# EAGLE design PCD (EAGLE 9.5.1)
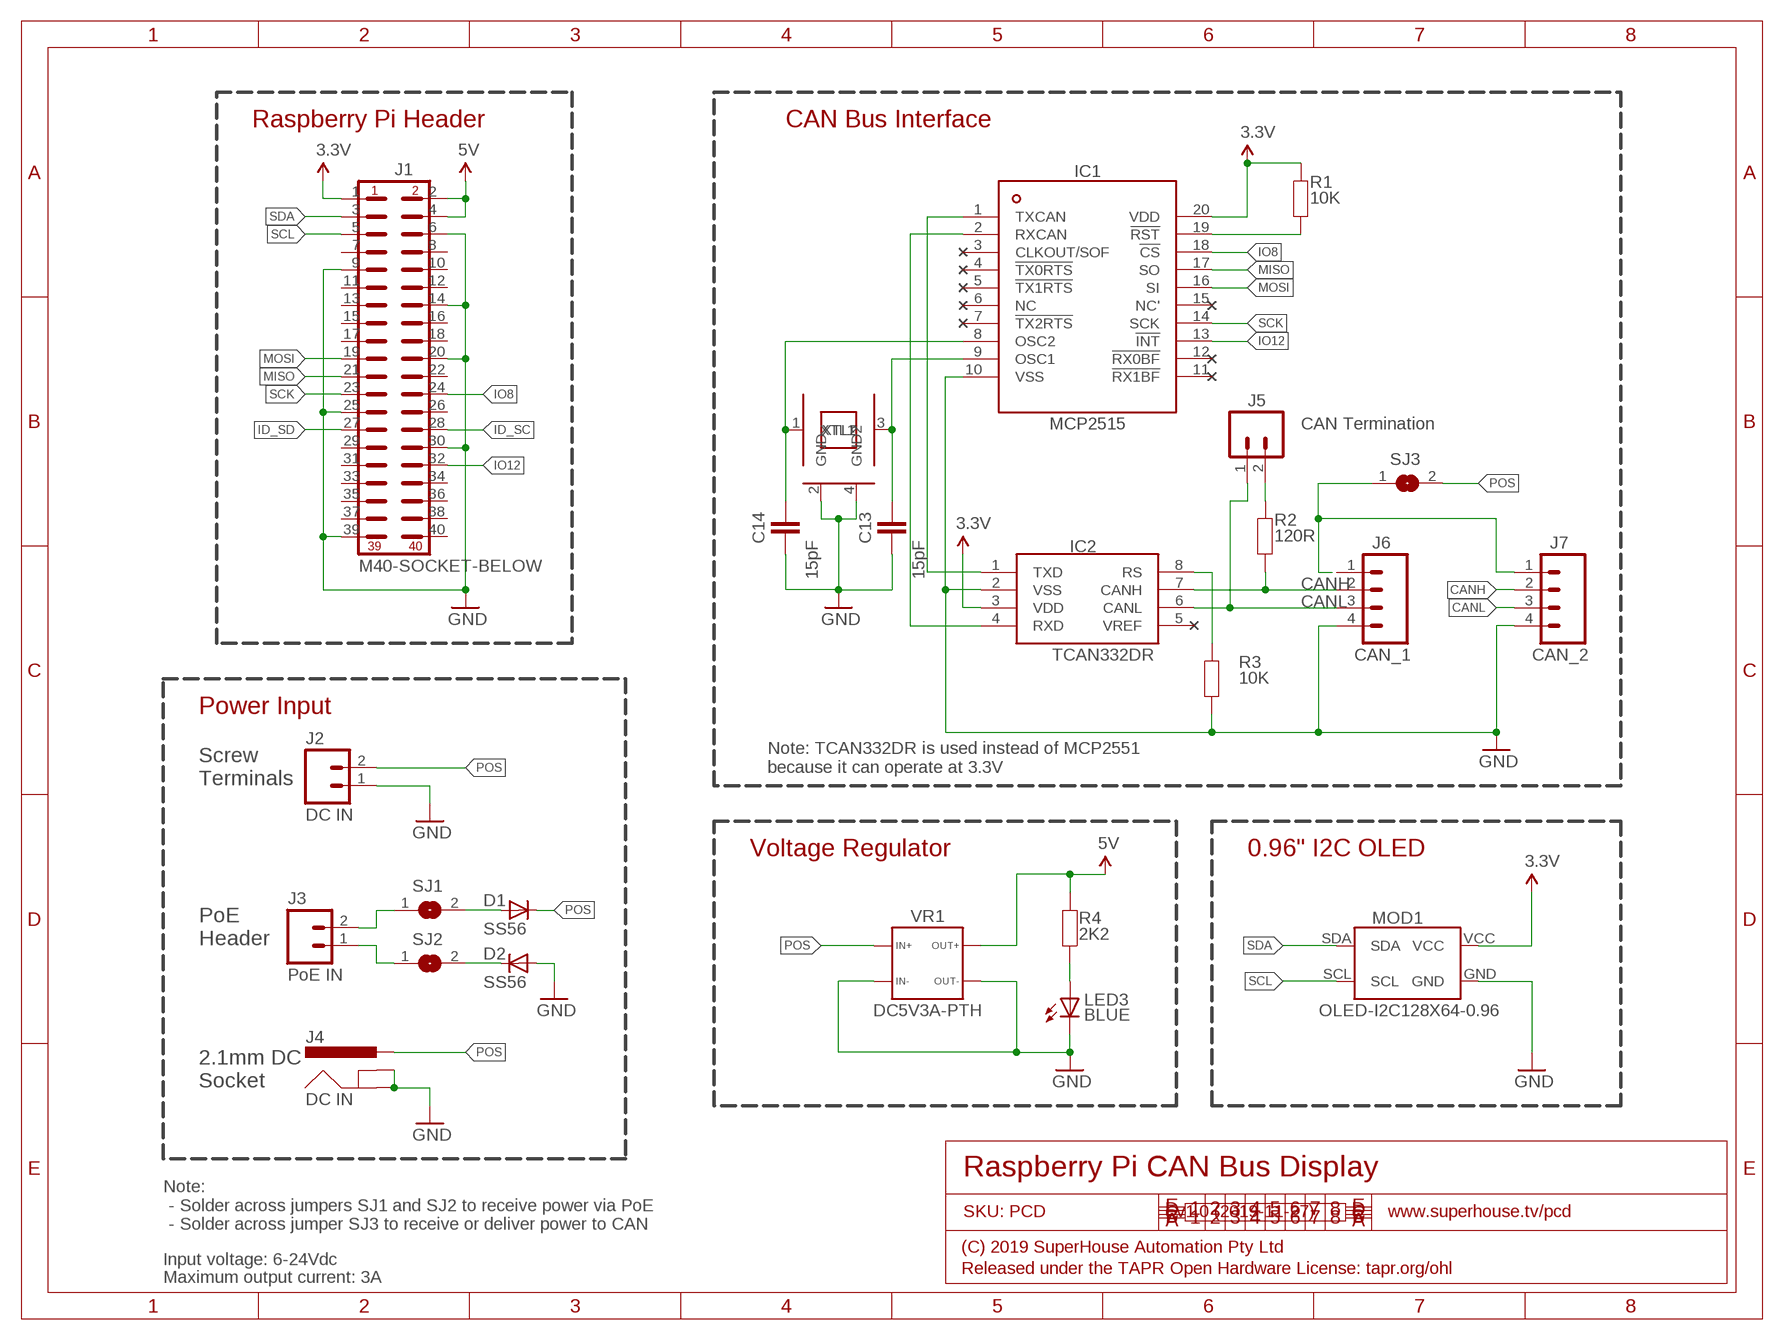
[diagram p0: schematic, sheet 1]

## Parts
C13  15pF  CAP0603  [C0603]
C14  15pF  CAP0603  [C0603]
D1  SS56  DIODESMA  [SMA-DIODE]
D2  SS56  DIODESMA  [SMA-DIODE]
IC1  MCP2515  [TSSOP20]
IC2  TCAN332DR  MCP2551  [SO08]
J1  M40-SOCKET-BELOW  [2X20-S-BELOW]
J2  DC IN  M02-SCREW-3.5MM  [SCREWTERMINAL-3.5MM-2]
J3  PoE IN  M02-SOCKET-BELOW  [1X02-S-BELOW]
J4  DC IN  POWER_JACK-SLOTS  [POWER_JACK_SLOTS]
J5  CAN Termination  M02-PIN  [1X02-P]
J6  CAN_1  M04-PIN  [1X04-P]
J7  CAN_2  M04-PIN  [1X04-P]
LED3  BLUE  LED0603  [LED-0603]
MOD1  OLED-I2C128X64-0.96  [OLED-128X64-0.96]
R1  10K  RESISTOR0603  [R0603]
R2  120R  RESISTOR0603  [R0603]
R3  10K  RESISTOR0603  [R0603]
R4  2K2  RESISTOR0603  [R0603]
SJ1  SJN  [SJ]
SJ2  SJN  [SJ]
SJ3  SJN  [SJ]
VR1  DC5V3A-PTH  [DC5V3A-PTH]
XTL3  16MHz  CRYSTAL-GND3X2  [CRYSTAL-SMD-3X2]

## Nets
3.3V: IC1.20(VDD) IC2.3(VDD) J1.1 MOD1.VCC R1.2
5V: J1.2 J1.4 R4.1 VR1.3A VR1.3B
CAN_PWR: J6.1 J7.1 SJ3.1
CANH: IC2.7(CANH) J6.2 J7.2 R2.1
CANL: IC2.6(CANL) J5.1 J6.3 J7.3
GND: C13.1 C14.1 D2.A IC1.10(VSS) IC2.2(VSS) J1.6 J1.9 J1.14 J1.20 J1.25 J1.30 J1.39 J2.1 J4.GND J4.GNDBREAK J6.4 J7.4 LED3.C MOD1.GND R3.1 VR1.1A VR1.1B VR1.4A VR1.4B XTL3.2(GND) XTL3.4(GND2)
ID_SC: J1.28
ID_SD: J1.27
IO8: IC1.18(!CS) J1.24
IO12: IC1.13(!INT) J1.32
MISO: IC1.17(SO) J1.21
MOSI: IC1.16(SI) J1.19
N$1: J3.1 SJ2.1
N$2: J3.2 SJ1.1
N$3: J5.2 R2.2
N$24: D1.A SJ1.2
N$25: D2.C SJ2.2
N$26: IC2.8(RS) R3.2
N$28: IC1.1(TXCAN) IC2.1(TXD)
N$29: IC1.2(RXCAN) IC2.4(RXD)
N$30: C13.2 IC1.9(OSC1) XTL3.3(XTL2)
N$48: C14.2 IC1.8(OSC2) XTL3.1(XTL1)
N$49: IC1.19(!RST) R1.1
N$203: LED3.A R4.2
POS: D1.C J2.2 J4.PWR SJ3.2 VR1.2A VR1.2B
SCK: IC1.14(SCK) J1.23
SCL: J1.5 MOD1.SCL
SDA: J1.3 MOD1.SDA
Unconnected: IC1.3(CLKOUT/SOF) IC1.4(!TX0RTS) IC1.5(!TX1RTS) IC1.6(NC) IC1.7(!TX2RTS) IC1.11(!RX1BF) IC1.12(!RX0BF) IC1.15(NC') IC2.5(VREF) J1.7 J1.8 J1.10 J1.11 J1.12 J1.13 J1.15 J1.16 J1.17 J1.18 J1.22 J1.26 J1.29 J1.31 J1.33 J1.34 J1.35 J1.36 J1.37 J1.38 J1.40

## Notes on the sheet
- Raspberry Pi Header | CAN Bus Interface
- Power Input
- Note: TCAN332DR is used instead of MCP2551
  because it can operate at 3.3V
- Screw
  Terminals
- Voltage Regulator | 0.96" I2C OLED
- PoE
  Header
- 2.1mm DC
  Socket
- Raspberry Pi CAN Bus Display
- SKU: PCD | v1.0 (2019-11-27) | www.superhouse.tv/pcd
- Note:
   - Solder across jumpers SJ1 and SJ2 to receive power via PoE
   - Solder across jumper SJ3 to receive or deliver power to CAN
- (C) 2019 SuperHouse Automation Pty Ltd
- Input voltage: 6-24Vdc
- Released under the TAPR Open Hardware License: tapr.org/ohl
- Maximum output current: 3A

## Library data of the parts
C13 C14 = SuperHouse-DiscreteSemi:CAP: Capacitor Standard ceramic capacitor
D1 D2 = SuperHouse-DiscreteSemi:DIODE: Diode Standard reverse protection diodes and small signal diodes. SMA package can handle up to about 1A. SOD-323 can handle about 200mA.
IC1 = SuperHouse-ICs:MCP2515: Microchip Technology’s MCP2515 is a stand-alone Controller Area Network (CAN) controller that implements the CAN specification, version 2.0B. It is capable of transmitting and receiving both standard and extended data and remote frames. The MCP2515 has two acceptance masks and six acceptance filters that are used to filter out unwanted messages, thereby reducing the host MCUs overhead. The MCP2515 interfaces with microcontrollers (MCUs) via an industry standard Serial Peripheral Interface (SPI).
IC2 = SuperHouse-ICs:MCP2551: CAN bus transceiver. Pin compatible chips with different specs include: MCP2551 (5V only) TCAN332DR (3.3V)
J1 = SuperHouse-Connectors:M40: 40-way header
J2 J3 J5 = SuperHouse-Connectors:M02: 2-way header Standard 1x2 header, and screw terminal variations
J4 = SuperHouse-Connectors:POWER_JACK: Power Jack This is the standard 5.5mm barrel jack for power. The PTH is the most common, proven, reliable, footprint. All others are experimental. The Slot footprint only works if the mill layer is transmitted to the PCB fab house so be warned. Spark Fun Electronics SKU : PRT-00119. Mating wall wart : TOL-00298 (and others)
J6 J7 = SuperHouse-Connectors:M04: 4-way header Standard 1x4 header, and screw terminal variations
LED3 = SuperHouse-LEDs:LED: LEDs Standard schematic elements and footprints for 5mm, 3mm, 1206, and 0603 sized LEDs. 5mm - Spark Fun Electronics SKU : COM-00529 (and others)
MOD1 = SuperHouse-Displays:OLED-I2C: OLED module with SSD1306 I2C driver
R1-R4 = SuperHouse-DiscreteSemi:RESISTOR: Resistor Standard resistors.
SJ1-SJ3 = freetronics-jon:SJ: SMD solder JUMPER
VR1 = SuperHouse-Regulators:DC5V3A: 5V 3A voltage regulator module from AliExpress
XTL3 = SuperHouse-Oscillators:CRYSTAL-GND: 3x2mm SMT crystal

## Board
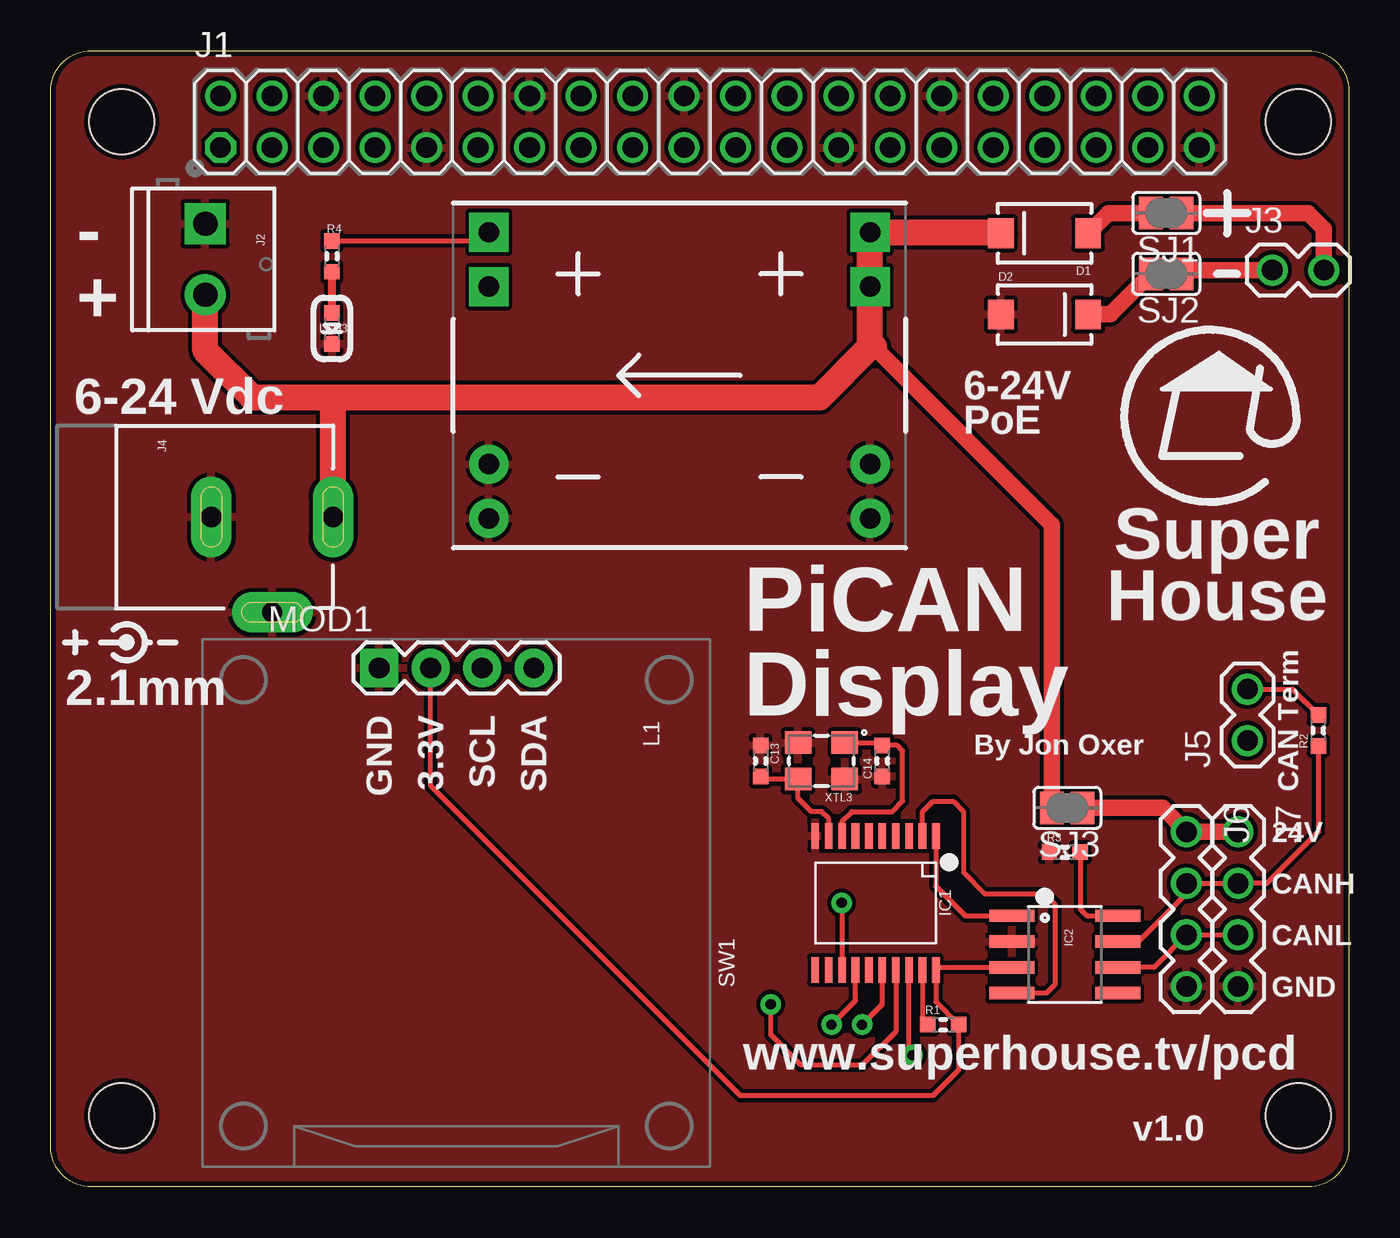
[diagram p1: board, top side]
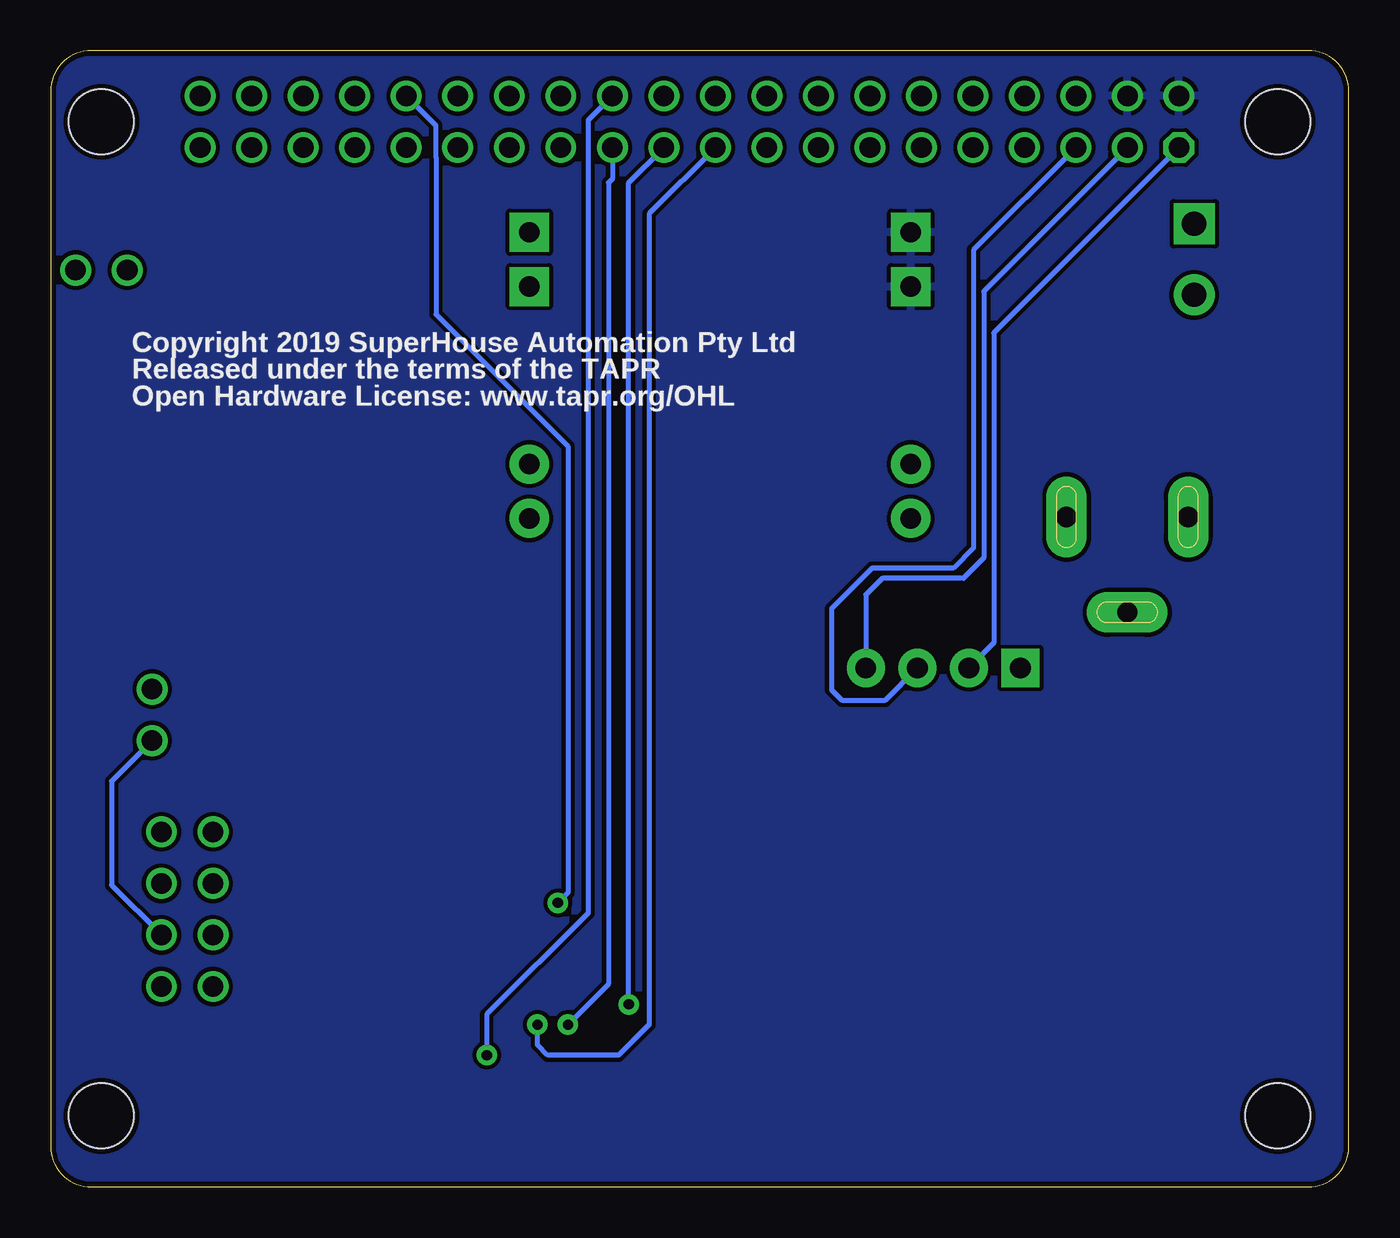
[diagram p2: board, bottom side, seen from below]

Size 64 x 56 mm. Coordinates in mm from the lower left corner, seen from the top.
Outline: 0,54 arc-90 2,56 62,56 arc-90 64,54 64,2 arc-90 62,0 2,0 arc-90 0,2 0,54
Copper layers (1*16): Top 0.035mm / dielectric 1.5mm / Bottom 0.035mm
Design rules "default *": minimum track width 8mil, minimum drill 0.4mm, track to track 8mil, track to pad 8mil, pad to pad 8mil, via to via 8mil, smd to smd 8mil, copper to edge 10mil, drill to drill 8mil, minimum pad ring 8mil, minimum via ring 10mil, stop-mask expansion 3mil, vias tented up to drill 25mil, thermal gap 8mil
Holes 3.2 mm at 3.5,52.5 61.5,52.5 61.5,3.5 3.5,3.5

### Footprints (pad centres in the part's own frame; a part is rotated, then mirrored left to right if it is on the bottom)
C0603 = smd 0.762 x 0.762: 1 -0.762,0; 2 0.762,0
SMA-DIODE = smd 1.27 x 1.47: A -2.15,0; C 2.15,0
TSSOP20 = smd 1.27 x 0.381: 1 -3.302,2.642; 2 -3.302,1.981; 3 -3.302,1.321; 4 -3.302,0.66; 5 -3.302,0; 6 -3.302,-0.66; 7 -3.302,-1.321; 8 -3.302,-1.981; 9 -3.302,-2.642; 10 -3.302,-3.302; 11 3.302,-3.302; 12 3.302,-2.642; 13 3.302,-1.981; 14 3.302,-1.321; 15 3.302,-0.66; 16 3.302,0; 17 3.302,0.66; 18 3.302,1.321; 19 3.302,1.981; 20 3.302,2.642
SO08 = smd 0.61 x 2.21: 1 -1.905,-2.616; 2 -0.635,-2.616; 3 0.635,-2.616; 4 1.905,-2.616; 5 1.905,2.616; 6 0.635,2.616; 7 -0.635,2.616; 8 -1.905,2.616
2X20-S-BELOW = drill 1.016 octagon: 1 0,0 | drill 1.016: 2 0,2.54; 3 2.54,0; 4 2.54,2.54; 5 5.08,0; 6 5.08,2.54; 7 7.62,0; 8 7.62,2.54; 9 10.16,0; 10 10.16,2.54; 11 12.7,0; 12 12.7,2.54; 13 15.24,0; 14 15.24,2.54; 15 17.78,0; 16 17.78,2.54; 17 20.32,0; 18 20.32,2.54; 19 22.86,0; 20 22.86,2.54; 21 25.4,0; 22 25.4,2.54; 23 27.94,0; 24 27.94,2.54; 25 30.48,0; 26 30.48,2.54; 27 33.02,0; 28 33.02,2.54; 29 35.56,0; 30 35.56,2.54; 31 38.1,0; 32 38.1,2.54; 33 40.64,0; 34 40.64,2.54; 35 43.18,0; 36 43.18,2.54; 37 45.72,0; 38 45.72,2.54; 39 48.26,0; 40 48.26,2.54
SCREWTERMINAL-3.5MM-2 = drill 1.2 pad 2.032 square: 1 -1.75,0 | drill 1.2 pad 2.032: 2 1.75,0
1X02-S-BELOW = drill 1.016: 1 0,0; 2 2.54,0
POWER_JACK_SLOTS = drill 1 pad 2 long: GND 0,7.7; GNDBREAK 4.7,10.7; PWR 0,13.7
1X02-P = drill 1.016: 1 0,0; 2 2.54,0
1X04-P = drill 1.016: 1 0,0; 2 2.54,0; 3 5.08,0; 4 7.62,0
LED-0603 = smd 0.762 x 0.762: A -0.762,0; C 0.762,0
OLED-128X64-0.96 = drill 1.016 pad 1.88 square: GND -3.81,10.58 | drill 1.016 pad 1.88: SCL 1.27,10.58; SDA 3.81,10.58; VCC -1.27,10.58
R0603 = smd 0.762 x 0.762: 1 -0.762,0; 2 0.762,0
SJ = smd 1.168 x 1.6: 1 -0.762,0; 2 0.762,0
DC5V3A-PTH = drill 1 pad 1.93: 1A -9.4,7.05; 1B -9.4,4.375; 4A 9.4,7.05; 4B 9.4,4.375 | drill 1 pad 1.93 square: 2A -9.4,-4.375; 2B -9.4,-7.05; 3A 9.4,-4.375; 3B 9.4,-7.05
CRYSTAL-SMD-3X2 = smd 1.3 x 1.1: 1 -1.15,-0.9; 2 1.15,-0.9; 3 1.15,0.9; 4 -1.15,0.9

### Placement (x,y rotation side)
C13  35,21 270 top
C14  41,21 90 top
D1  49,47 180 top
D2  49,43 0 top
IC1  41,14 270 top
IC2  50,11.46 270 top
J1  8.37,51.23 0 top
J2  7.62,45.72 270 top
J3  60.23,45.19 0 top
J4  0.22,33.02 270 top
J5  59,22 90 top
J6  56,17.5 270 top
J7  58.54,17.5 270 top
LED3  13.86,42.31 270 top
MOD1  20,15 0 top
R1  44,8 0 top
R2  62.5,22.5 90 top
R3  50,16.5 0 top
R4  13.86,45.87 270 top
SJ1  55,48 180 top
SJ2  55,45 180 top
SJ3  50.12,18.68 180 top
VR1  31,40 180 top
XTL3  38,21 180 top

### Tracks (layer width: path | path; a pad name or v marks a point on that pad's centre or on a via)
3.3V
  Top 0.254: IC2.3 43.64,10.82 IC1.20 43.64,9.12 R1.2 44.76,5.76 43.5,4.5 34,4.5 18.73,19.77 MOD1.VCC
  Bottom 0.254: J1.1 17.5,42.1 17.5,26.81 MOD1.VCC
5V
  Top 0.254: R4.1 20.78,46.63 VR1.3B
  pour Bottom: 2,56.32 61.94,56.32 arc-90 63.94,54.32 63.94,2 arc-90 61.94,0 2,0 arc-90 0,2 0,54.32 arc-90
CAN_PWR
  Top 0.813: J7.1 J6.1 54.82,18.68 SJ3.1
CANH
  Top 0.254: IC2.7 53.63,12.1 56,14.46 J6.2 J7.2 59.96,14.96 62.5,17.5 R2.1
CANL
  Top 0.254: IC2.6 54.41,10.82 J6.3 J7.3
  Bottom 0.254: J5.1 61,20 61,14.88 J7.3
GND
  pour Top: 2,56 64,56 64,0 2,0 arc-90 0,2 0,54 arc-90
IO8  (via drill 0.5)
  Top 0.254: v42.5,6.5 42.32,6.68 IC1.18
  Bottom 0.254: J1.24 37.5,52.58 37.5,13.5 42.5,8.5 v42.5,6.5
IO12  (via drill 0.5)
  Top 0.254: v39,14 39,10.72 IC1.13
  Bottom 0.254: J1.32 45.02,52.32 45.02,50.78 45,50.76 45,43 38.5,36.5 38.5,14.5 v39,14
MISO  (via drill 0.5)
  Top 0.254: IC1.17 41.66,7.66 40,6 37,6 35.5,7.5 v35.5,9
  Bottom 0.254: J1.21 35.5,49.5 v35.5,9
MOSI  (via drill 0.5)
  Top 0.254: v40,8 41,9 IC1.16
  Bottom 0.254: J1.19 34.5,47.96 34.5,8 36,6.5 39.5,6.5 40,7 v40,8
N$1
  Top 0.813: SJ2.1 55.95,45.19 J3.1
N$2
  Top 0.813: J3.2 62.77,47.23 62,48 SJ1.1
N$3
  Top 0.254: J5.2 61.22,24.54 R2.2
N$24
  Top 0.813: D1.A 52.15,48 SJ1.2
N$25
  Top 0.813: SJ2.2 52.24,43 D2.C
N$26
  Top 0.254: R3.2 50.76,13.7 51.09,13.37 IC2.8
N$28
  Top 0.254: IC1.1 43.64,14.82 45.09,13.37 IC2.1
N$29
  Top 0.254: IC1.2 42.98,18.48 43.5,19 44.5,19 45,18.5 45,15.5 46.04,14.46 49,14.46 49.5,13.96 49.5,9.96 49.09,9.55 IC2.4
N$30
  Top 0.254: C13.2 35.14,20.1 XTL3.3 36.85,19.15 37.5,18.5 38,18.5 38.36,18.14 IC1.9
N$48
  Top 0.254: XTL3.1 40.86,21.9 C14.2 41.74,21.76 42,21.5 42,19 41.5,18.5 39.5,18.5 39.02,18.02 IC1.8
N$49
  Top 0.254: IC1.19 42.98,8.26 R1.1
N$203
  Top 0.406: LED3.A R4.2
POS
  Top 0.813: 40.6,41.4 49.36,32.64 SJ3.2
  Top 1.27: J4.PWR 13.92,38.92 | 13.92,38.92 9.92,38.92 7.62,41.22 J2.2 | 13.92,38.92 37.92,38.92 40.4,41.4 | D1.C 46.8,47.05 VR1.2B VR1.2A 40.4,41.4 | 40.4,41.4 40.6,41.4
SCK  (via drill 0.5)
  Top 0.254: v38.5,8 39.68,9.18 IC1.14
  Bottom 0.254: J1.23 36.31,49.69 36.5,49.5 36.5,10 v38.5,8
SCL
  Bottom 0.254: J1.5 18.5,46.18 18.5,31.5 19.5,30.5 23.5,30.5 25.5,28.5 25.5,24.5 25,24 22.85,24 MOD1.SCL
SDA
  Bottom 0.254: J1.3 18,44.14 18,31 19,30 23,30 23.81,29.19 MOD1.SDA

### Text on the board
tPlace: - | + | 6-24 Vdc | 6-24V / PoE | Super / House | 2.1mm | GND | 3.3V | SCL | SDA | PiCAN / Display | By Jon Oxer | CAN Term | 24V | CANH | CANL | GND | www.superhouse.tv/pcd | v1.0
bPlace: Copyright 2019 SuperHouse Automation Pty Ltd / Released under the terms of the TAPR / Open Hardware License: www.tapr.org/OHL
tNames: L1 | SW1
tDocu: K | A | A | K | A | K